# Altium schematic sheet A0.SchDoc
size A3; SheetNumber: 1; SheetTotal: 6
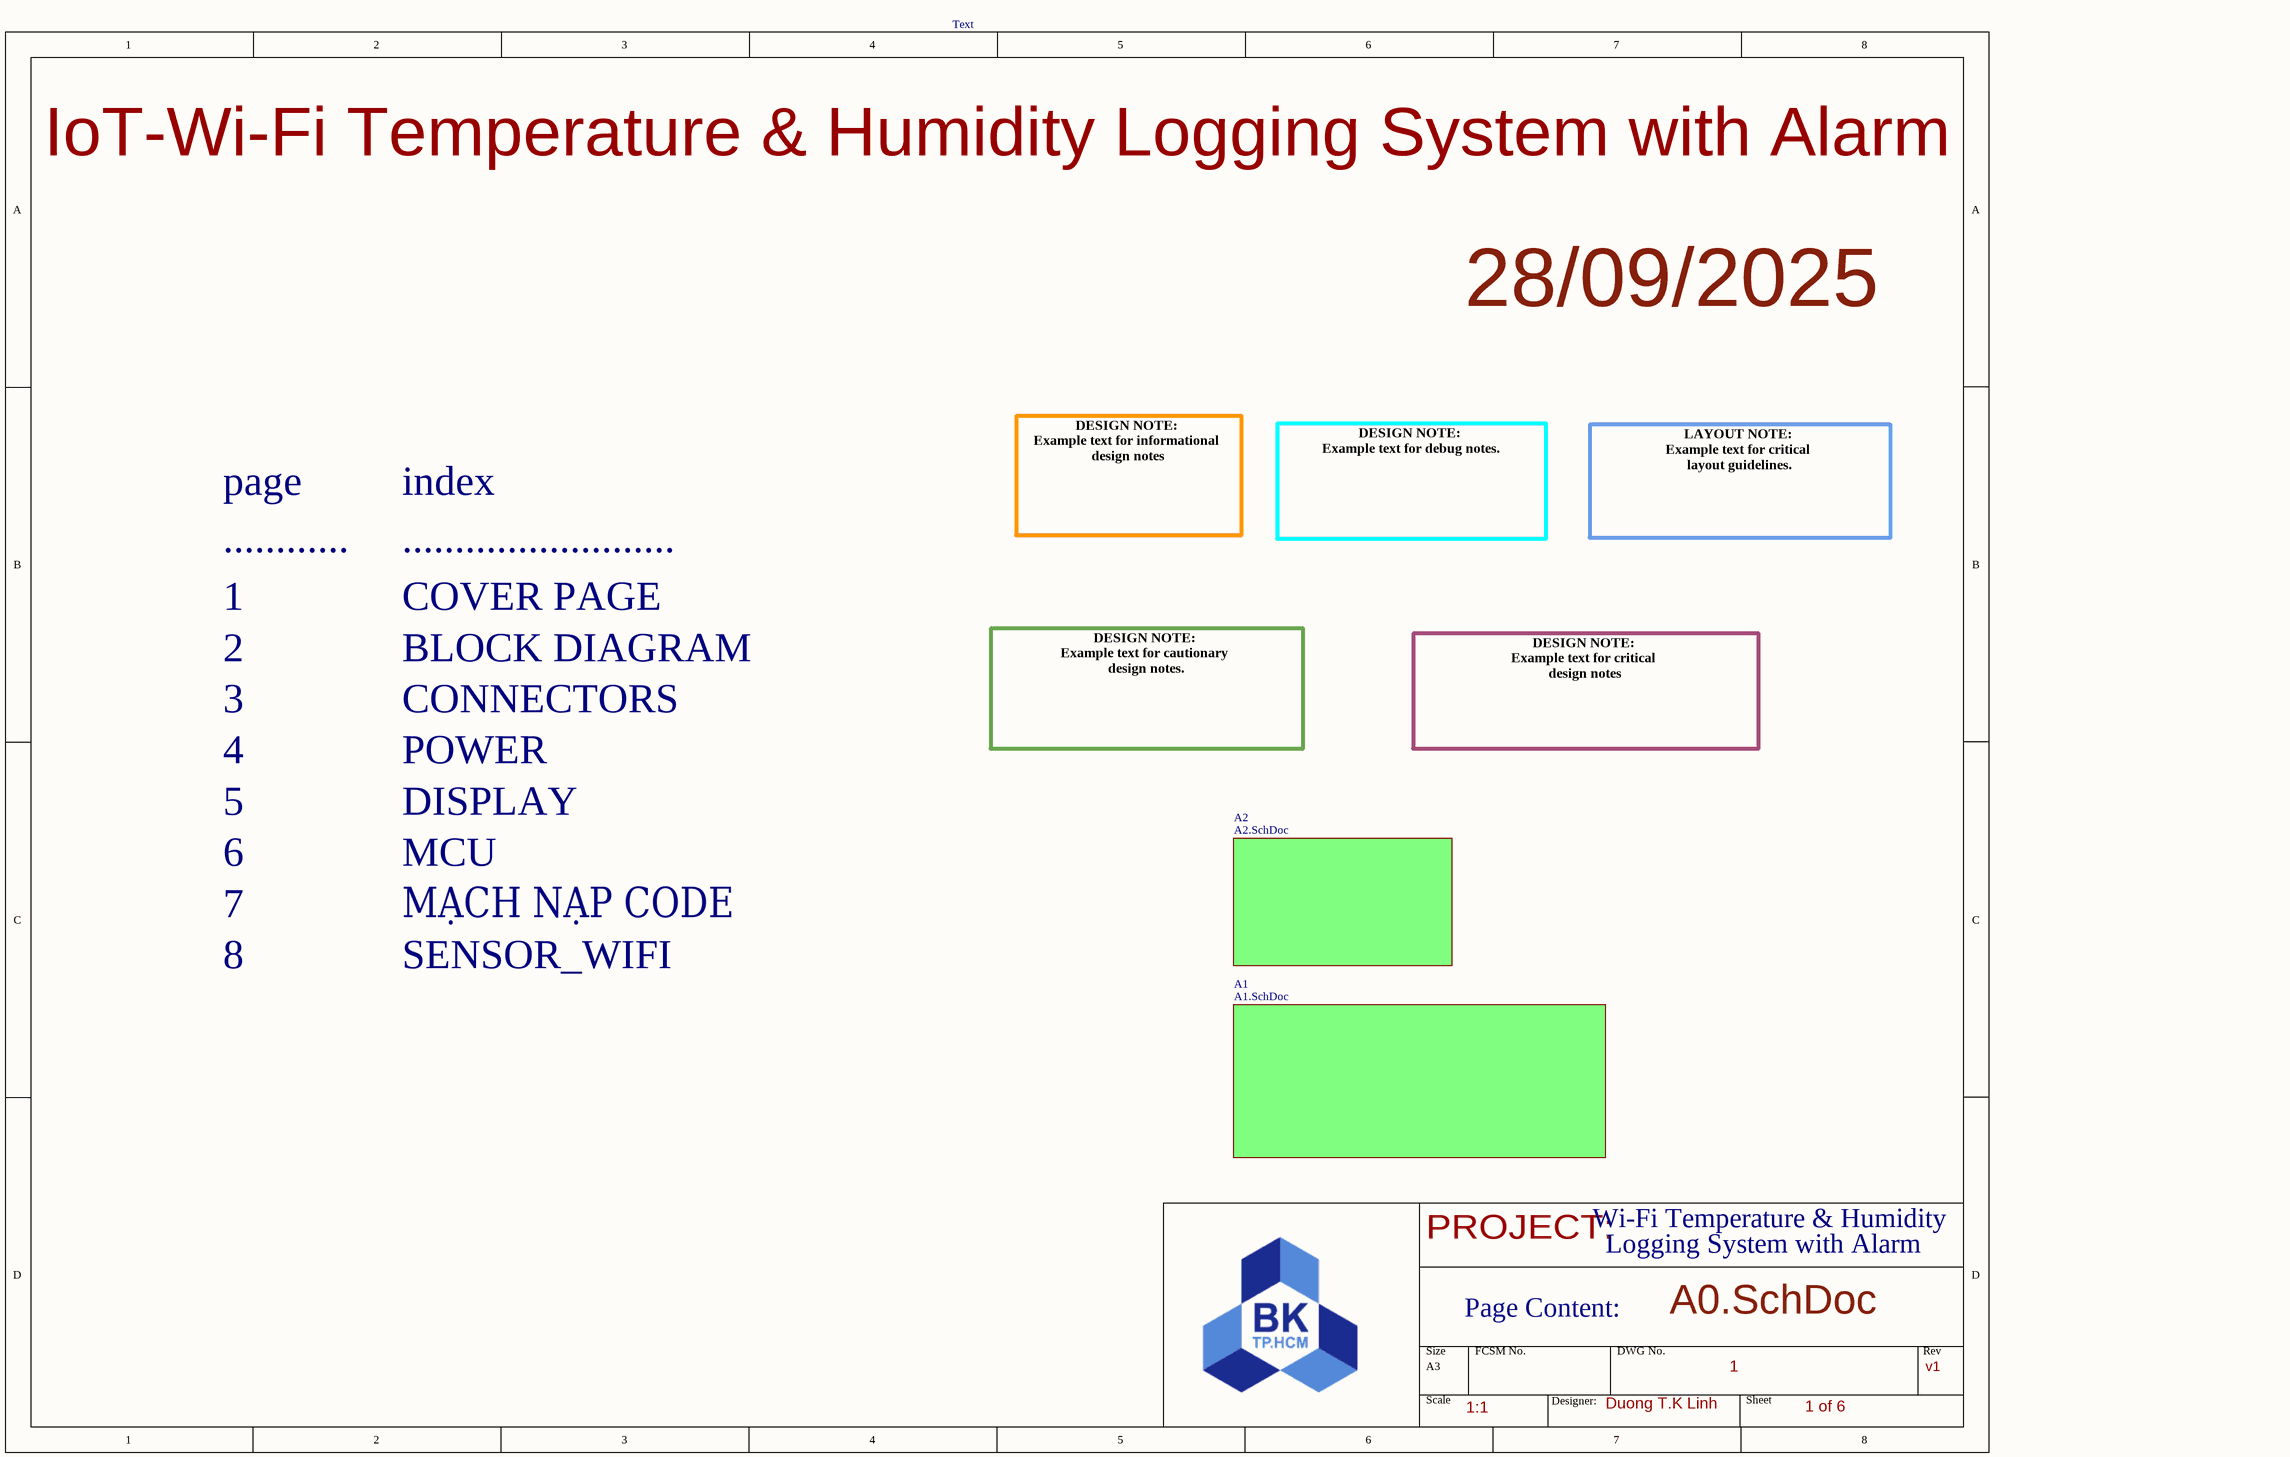
[diagram p0: A0.SchDoc]

## Sub-sheets
A1 = A1.SchDoc: no entries
A2 = A2.SchDoc: no entries

## Notes on the sheet
- Text
- IoT-Wi-Fi Temperature & Humidity Logging System with Alarm
- 28/09/2025
- page
- index
- ............
- ..........................
- DESIGN NOTE:
  Example text for informational
  design notes
- DESIGN NOTE:
  Example text for debug notes.
- LAYOUT NOTE:
  Example text for critical
  layout guidelines.
- 1
- COVER PAGE
- 2
- BLOCK DIAGRAM
- 3
- 4
- CONNECTORS
- POWER
- DESIGN NOTE:
  Example text for cautionary
  design notes.
- DESIGN NOTE:
  Example text for critical
  design notes
- 5
- DISPLAY
- 6
- MCU
- 7
- MẠCH NẠP CODE
- 8
- SENSOR_WIFI
- PROJECT:
- Wi-Fi Temperature & Humidity
- Logging System with Alarm
- Page Content:
- A0.SchDoc
- 1:1
- Designer:
- Duong T.K Linh
- 1 of 6
- v1